# EAGLE design Power Rail (EAGLE 9.6.2)
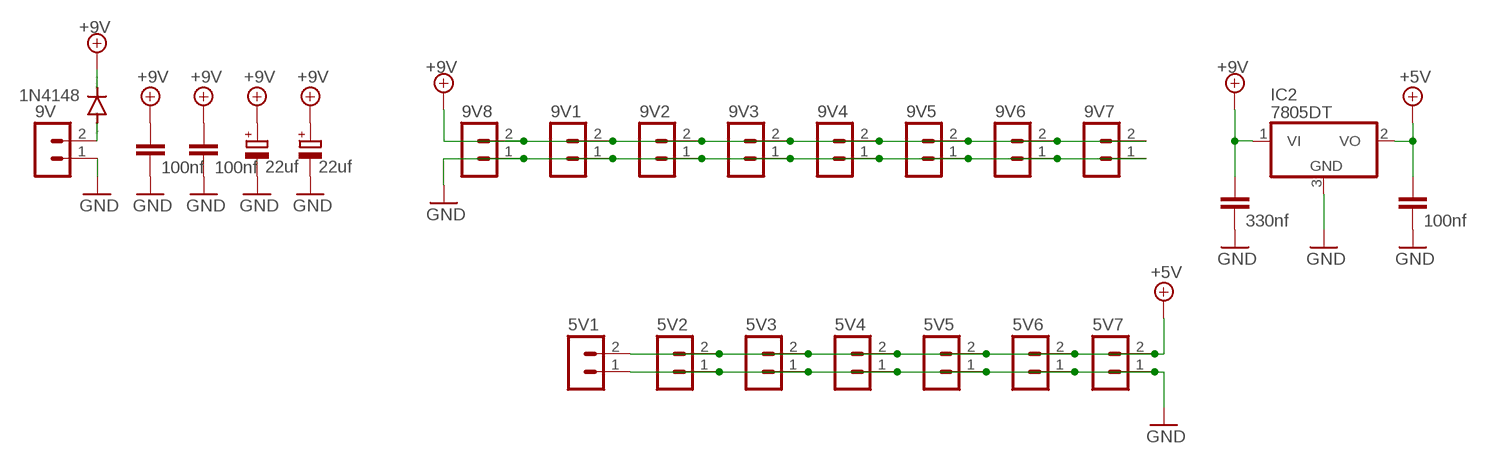
[diagram p0: schematic, sheet 1]

## Parts
5V1  B2B-PH-K-S  [B2B-PH-K-S]
5V2  B2B-PH-K-S  [B2B-PH-K-S]
5V3  B2B-PH-K-S  [B2B-PH-K-S]
5V4  B2B-PH-K-S  [B2B-PH-K-S]
5V5  B2B-PH-K-S  [B2B-PH-K-S]
5V6  B2B-PH-K-S  [B2B-PH-K-S]
5V7  B2B-PH-K-S  [B2B-PH-K-S]
9V  B2B-PH-K-S  [B2B-PH-K-S]
9V1  B2B-PH-K-S  [B2B-PH-K-S]
9V2  B2B-PH-K-S  [B2B-PH-K-S]
9V3  B2B-PH-K-S  [B2B-PH-K-S]
9V4  B2B-PH-K-S  [B2B-PH-K-S]
9V5  B2B-PH-K-S  [B2B-PH-K-S]
9V6  B2B-PH-K-S  [B2B-PH-K-S]
9V7  B2B-PH-K-S  [B2B-PH-K-S]
9V8  B2B-PH-K-S  [B2B-PH-K-S]
C1  330nf  C-EU050-024X044  [C050-024X044]
C2  100nf  C-EU050-024X044  [C050-024X044]
C3  22uf  CPOL-EUE2-5  [E2-5]
C4  22uf  CPOL-EUE2-5  [E2-5]
C5  100nf  C-EU050-024X044  [C050-024X044]
C6  100nf  C-EU050-024X044  [C050-024X044]
D2  1N4148  1N4148DO35-7  [DO35-7]
IC2  7805DT  [TO252]

## Nets
+5V: 5V1.2 5V2.2 5V3.2 5V4.2 5V5.2 5V6.2 5V7.2 C2.1 IC2.2(VO)
+9V: 9V1.2 9V2.2 9V3.2 9V4.2 9V5.2 9V6.2 9V7.2 9V8.2 C1.1 C3.+ C4.+ C5.1 C6.1 D2.C IC2.1(VI)
GND: 5V1.1 5V2.1 5V3.1 5V4.1 5V5.1 5V6.1 5V7.1 9V1.1 9V2.1 9V3.1 9V4.1 9V5.1 9V6.1 9V7.1 9V8.1 9V.1 C1.2 C2.2 C3.- C4.- C5.2 C6.2 IC2.3(GND)
N$1: 9V.2 D2.A

## Library data of the parts
5V1-5V7 9V 9V1-9V8 = con-JST PH:B2B-PH: JST PH series header 2.00mm pitch disconnectable crimp style connectors, vertical (side entry type), 2 pins
C1 C2 C5 C6 = rcl:C-EU: CAPACITOR, European symbol; SPICEPREFIX: C
C3 C4 = rcl:CPOL-EU: POLARIZED CAPACITOR, European symbol; SPICEPREFIX: C
D2 = diode:1N4148: DIODE high speed (Philips)
IC2 = linear4:78*: Positive VOLTAGE REGULATOR

## Board
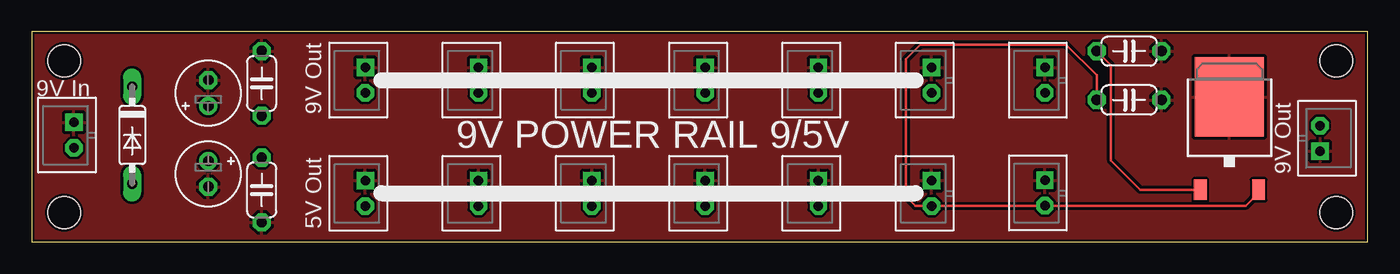
[diagram p1: board, top side]
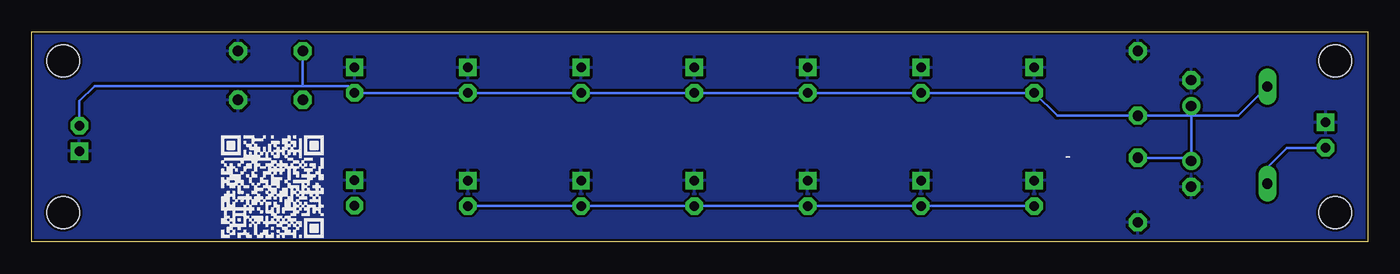
[diagram p2: board, bottom side, seen from below]

Size 104.83 x 16.5 mm. Coordinates in mm from the lower left corner, seen from the top.
Outline: 0,0 104.83,0 104.83,16.5 0,16.5 0,0
Copper layers (1*16): Top 0.035mm / dielectric 1.5mm / Bottom 0.035mm
Design rules "SparkFun": minimum track width 8mil, minimum drill 20mil, track to track 8mil, track to pad 8mil, pad to pad 8mil, via to via 8mil, smd to smd 8mil, copper to edge 8mil, drill to drill 8mil, minimum pad ring 12mil, minimum via ring 10mil, stop-mask expansion 4mil, vias tented up to drill 20mil, thermal gap 10mil
Holes 2.54 mm at 2.54,14.22 2.54,2.29 102.36,14.22 102.36,2.29

### Footprints (pad centres in the part's own frame; a part is rotated, then mirrored left to right if it is on the bottom)
B2B-PH-K-S = drill 0.75 pad 1.3 square: 1 1,0 | drill 0.75 pad 1.3 octagon: 2 -1,0
C050-024X044 = drill 0.813 octagon: 1 -2.54,0; 2 2.54,0
E2-5 = drill 0.813 pad 1.27: + -1.016,0 | drill 0.813 pad 1.27 octagon: - 1.016,0
DO35-7 = drill 0.813 long: A 3.81,0; C -3.81,0
TO252 = smd 1 x 1.6: 1 -2.28,-4.8; 2 2.28,-4.8 | smd 5.4 x 6.2: 3 0,2.5

### Placement (x,y rotation side)
5V1  70.61,3.81 90 top
5V2  26.16,3.81 90 top
5V3  35.05,3.81 90 top
5V4  43.94,3.81 90 top
5V5  52.83,3.81 90 top
5V6  61.72,3.81 90 top
5V7  79.5,3.84 90 top
9V  3.3,8.38 90 top
9V1  26.16,12.7 90 top
9V2  35.05,12.7 90 top
9V3  43.94,12.7 90 top
9V4  52.83,12.7 90 top
9V5  61.72,12.7 90 top
9V6  70.61,12.7 90 top
9V7  79.5,12.7 90 top
9V8  101.09,8.13 270 top
C1  86.11,14.99 0 top
C2  86.11,11.15 0 top
C3  13.84,11.68 90 top
C4  13.84,5.33 270 top
C5  18.03,12.45 90 top
C6  18.03,4.06 270 top
D2  7.87,8.38 270 top
IC2  93.98,8.89 0 top

### Tracks (layer width: path | path; a pad name or v marks a point on that pad's centre or on a via)
+5V
  Top 0.203: IC2.2 96.26,3.83 95.27,2.84 5V7.2 70.64,2.84 5V1.2 70.6,2.8 69.33,2.8 68.58,3.56 68.58,14.35 69.72,15.49 81.15,15.49 83.57,13.08 C2.1
  Bottom 0.203: 5V2.2 5V3.2 5V4.2 5V5.2 5V6.2 5V1.2
+9V
  Top 0.203: IC2.1 86.97,4.09 84.68,6.38 84.68,13.87 C1.1
  Bottom 0.203: 13.84,6.6 C3.+ 13.84,9.91 | 13.84,6.6 C4.+ | 13.84,9.91 10.16,9.91 D2.C | 13.84,9.91 C5.1 24.37,9.91 9V1.2 9V2.2 9V3.2 9V4.2 9V5.2 9V6.2 9V7.2 79.5,11.73 80.01,12.24 83.59,12.24 | C6.1 13.84,6.6 | 83.59,12.24 99.9,12.24 101.09,11.05 9V8.2 | C1.1 83.57,12.27 83.59,12.24
GND
  pour Top: 0,16.51 104.9,16.51 104.9,0 0,0
  pour Bottom: 0,16.51 104.9,16.51 104.9,0 0,0
N$1
  Bottom 0.203: 9V.2 6.33,7.38 7.87,5.84 D2.A

### Text on the board
tPlace: 9V In | 9V Out | 9V POWER RAIL 9/5V | 9V Out | 5V Out